# Altium schematic sheet 12V Buck.SchDoc
size B; SheetNumber: 3; SheetTotal: 7
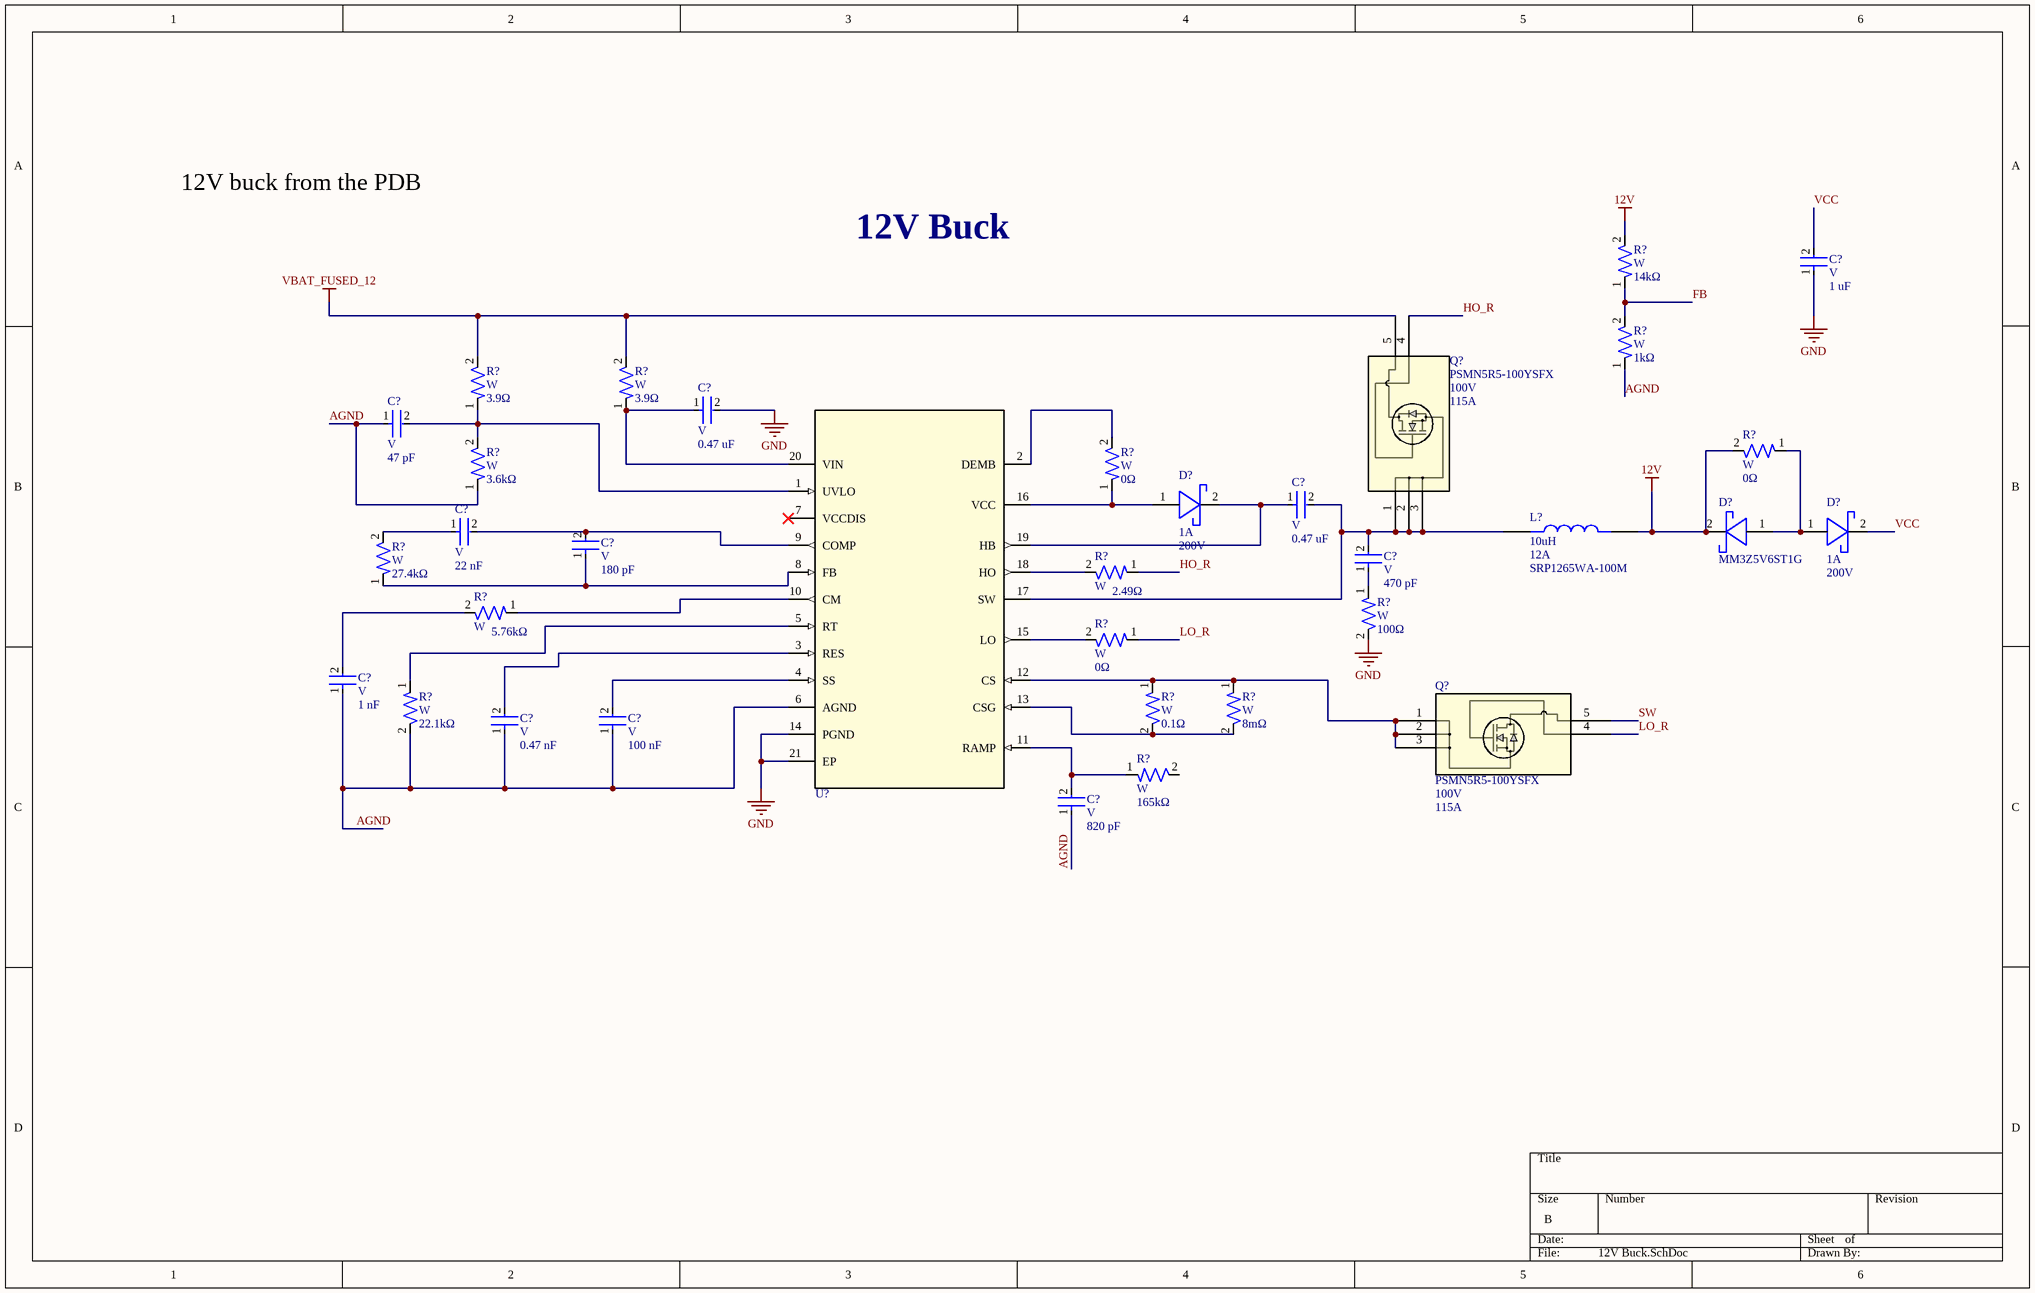
[diagram p0: 12V Buck.SchDoc]

## Parts
(Parts that share a designator on the sheet are numbered #1, #2 ... from top to bottom, then left to right.)
C?#1  Voltage Rating: V  Capacitance: 1 uF  [CAP-0805]  (hidden comment: CAP 0805)
C?#2  Voltage Rating: V  Capacitance: 0.47 uF  [CAP-0805]  (hidden comment: CAP 0805)
C?#3  Voltage Rating: V  Capacitance: 47 pF  [CAP-0805]  (hidden comment: CAP 0805)
C?#4  Voltage Rating: V  Capacitance: 0.47 uF  [CAP-0805]  (hidden comment: CAP 0805)
C?#5  Voltage Rating: V  Capacitance: 22 nF  [CAP-0805]  (hidden comment: CAP 0805)
C?#6  Voltage Rating: V  Capacitance: 180 pF  [CAP-0805]  (hidden comment: CAP 0805)
C?#7  Voltage Rating: V  Capacitance: 470 pF  [CAP-0805]  (hidden comment: CAP 0805)
C?#8  Voltage Rating: V  Capacitance: 1 nF  [CAP-0805]  (hidden comment: CAP 0805)
C?#9  Voltage Rating: V  Capacitance: 0.47 nF  [CAP-0805]  (hidden comment: CAP 0805)
C?#10  Voltage Rating: V  Capacitance: 100 nF  [CAP-0805]  (hidden comment: CAP 0805)
C?#11  Voltage Rating: V  Capacitance: 820 pF  [CAP-0805]  (hidden comment: CAP 0805)
D?#1  Current Rating: 1A  Reverse Voltage: 200V  [SMA_DIO]  (hidden comment: SS1200)
D?#2  MM3Z5V6ST1G  [DIO_MM3Z3V0T1G - duplicate]
D?#3  Current Rating: 1A  Reverse Voltage: 200V  [SMA_DIO]  (hidden comment: SS1200)
L?  SRP1265WA-100M  value 10uH  Current: 12A  [IND_SRP1265_BRN]
Q?#1  PSMN5R5-100YSFX  Vdss: 100V  Drain Current: 115A  [LFPAK_SOT669_NEX]
Q?#2  PSMN5R5-100YSFX  Vdss: 100V  Drain Current: 115A  [LFPAK_SOT669_NEX]
R?#1  Wattage: W  Resistance: 14kΩ  [RES-0805]  (hidden comment: RES 0805)
R?#2  Wattage: W  Resistance: 1kΩ  [RES-0805]  (hidden comment: RES 0805)
R?#3  Wattage: W  Resistance: 3.9Ω  [RES-0805]  (hidden comment: RES 0805)
R?#4  Wattage: W  Resistance: 3.9Ω  [RES-0805]  (hidden comment: RES 0805)
R?#5  Wattage: W  Resistance: 0Ω  [RES-0805]  (hidden comment: RES 0805)
R?#6  Wattage: W  Resistance: 3.6kΩ  [RES-0805]  (hidden comment: RES 0805)
R?#7  Wattage: W  Resistance: 0Ω  [RES-0805]  (hidden comment: RES 0805)
R?#8  Wattage: W  Resistance: 27.4kΩ  [RES-0805]  (hidden comment: RES 0805)
R?#9  Wattage: W  Resistance: 2.49Ω  [RES-0805]  (hidden comment: RES 0805)
R?#10  Wattage: W  Resistance: 5.76kΩ  [RES-0805]  (hidden comment: RES 0805)
R?#11  Wattage: W  Resistance: 100Ω  [RES-0805]  (hidden comment: RES 0805)
R?#12  Wattage: W  Resistance: 0Ω  [RES-0805]  (hidden comment: RES 0805)
R?#13  Wattage: W  Resistance: 22.1kΩ  [RES-0805]  (hidden comment: RES 0805)
R?#14  Wattage: W  Resistance: 0.1Ω  [RES-0805]  (hidden comment: RES 0805)
R?#15  Wattage: W  Resistance: 8mΩ  [RES-0805]  (hidden comment: RES 0805)
R?#16  Wattage: W  Resistance: 165kΩ  [RES-0805]  (hidden comment: RES 0805)
U?  LM5117PMHX/NOPB  [IC-20-HTSSOP]  (value not drawn)

## Nets
12V: D?#2.2 L?.2 R?#1.2 R?#5.2
GND: C?#1.1 C?#2.2 R?#11.2 U?.14(PGND) U?.21(EP)
VBAT_FUSED_12: Q?#1.5 R?#3.2 R?#4.2
AGND: C?#3.1 C?#8.1 C?#9.1 C?#10.1 C?#11.1 R?#2.1 R?#6.1 R?#13.2 U?.6(AGND)
FB: R?#1.1 R?#2.2
HO_R: Q?#1.4 R?#9.1
LO_R: Q?#2.4 R?#12.1
SW: Q?#2.5
VCC: C?#1.2 D?#3.2(ANODE)
NetC?#2_1: C?#2.1 R?#4.1 U?.20(VIN)
NetC?#3_2: C?#3.2 R?#3.1 R?#6.2 U?.1(UVLO)
NetC?#4_1: C?#4.1 D?#1.2(ANODE) U?.19(HB)
NetC?#4_2: C?#4.2 C?#7.2 L?.1 Q?#1.1 Q?#1.2 Q?#1.3 U?.17(SW)
NetC?#5_1: C?#5.1 R?#8.2
NetC?#5_2: C?#5.2 C?#6.2 U?.9(COMP)
NetC?#6_1: C?#6.1 R?#8.1 U?.8(FB)
NetC?#7_1: C?#7.1 R?#11.1
NetC?#8_2: C?#8.2 R?#10.2
NetC?#9_2: C?#9.2 U?.3(RES)
NetC?#10_2: C?#10.2 U?.4(SS)
NetC?#11_2: C?#11.2 R?#16.1 U?.11(RAMP)
NetD?#1_1: D?#1.1(CATHODE) R?#7.1 U?.16(VCC)
NetD?#2_1: D?#2.1 D?#3.1(CATHODE) R?#5.1
NetQ?#2_1: Q?#2.1 Q?#2.2 Q?#2.3 R?#14.1 R?#15.1 U?.12(CS)
NetR?#7_2: R?#7.2 U?.2(DEMB)
NetR?#9_2: R?#9.2 U?.18(HO)
NetR?#10_1: R?#10.1 U?.10(CM)
NetR?#12_2: R?#12.2 U?.15(LO)
NetR?#13_1: R?#13.1 U?.5(RT)
NetR?#14_2: R?#14.2 R?#15.2 U?.13(CSG)

Not connected (* = marked no-connect by the designer): R?#16 2; U? 7(VCCDIS)*

## Notes on the sheet
- 12V buck from the PDB
- 12V Buck

## Library data of the parts
D?#1 D?#3 = DIO-SCHOTTKY-0004: DIODE SCHOTTKY 200V 1A SMA; ComponentLink1Description: Datasheet; ComponentLink1URL: https://www.digikey.com/en/products/detail/mdd/ss1200/15911596
D?#2 = TESTDIOZ
L? = IND-10U-0002: 10 µH Shielded Inductor 12 A 16.5mOhm Max Nonstandard; MP: SRP1265A-100M; Package: None; Price: None; Availability: Unavailable
Q?#1 Q?#2 = NMOS-115A-0001: N-Channel 100 V 115A (Tc) 238W (Tc) Surface Mount LFPAK56, Power-SO8; Manufacturer_Part_Number: TPH2R506PL; Vgs (max): 20V; Vgs: 4V @ 1mA; RefDes: RefDes
U? = IC-BUCK-0011: Buck Regulator Positive Output Step-Down DC-DC Controller IC 20-HTSSOP; Manufacturer Part Number: TPS62933ODRLR; Manufacturer: Texas Instruments; Assembled?: no; Type: Buck